# Altium project VoronChassisCircuitBoard.PrjPcb
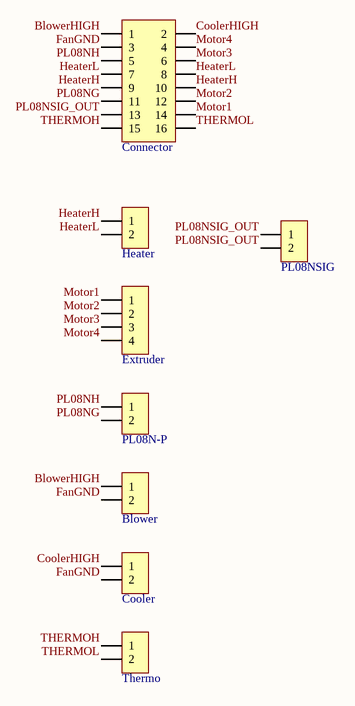
[diagram p0: Schematic.SchDoc]
1 sheet, 8 parts. Net scope: global (net labels, ports and power ports of the same name join across sheets).
Board file: Voron_Chassis_Circuit_PCB.PcbDoc

## Sheet Schematic.SchDoc
size A4

### Parts
Blower  HDR-1X2  [XH2.54-LI-2P]  (value not drawn)
Connector  Header 8X2  [IDC2.54-LI-2x8P]  (value not drawn)
Cooler  HDR-1X2  [XH2.54-LI-2P]  (value not drawn)
Extruder  HDR-1X4  [XH2.54-LI-4P]  (value not drawn)
Heater  HDR-1X2  [KF128-5.08-2P]  (value not drawn)
PL08N-P  HDR-1X2  [XH2.54-LI-2P]  (value not drawn)
PL08NSIG  HDR-1X2  [KF2510-LI-2P]  (value not drawn)
Thermo  HDR-1X2  [XH2.54-LI-2P]  (value not drawn)

### Nets
BlowerHIGH: Blower.1 Connector.1
CoolerHIGH: Connector.2 Cooler.1
FanGND: Blower.2 Connector.3 Cooler.2
HeaterH: Connector.9 Connector.10 Heater.1
HeaterL: Connector.7 Connector.8 Heater.2
Motor1: Connector.14 Extruder.1
Motor2: Connector.12 Extruder.2
Motor3: Connector.6 Extruder.3
Motor4: Connector.4 Extruder.4
PL08NG: Connector.11 PL08N-P.2
PL08NH: Connector.5 PL08N-P.1
PL08NSIG_OUT: Connector.13 PL08NSIG.1 PL08NSIG.2
THERMOH: Connector.15 Thermo.1
THERMOL: Connector.16 Thermo.2

### Library data of the parts
Blower Cooler PL08N-P PL08NSIG Thermo = Header 2: 2P接插件; 版权归属: 封装库来自淘宝 ID：黄晶宝石; BOM名称: 2P接插件; 联系售后: https://shop463601444.taobao.com
Connector = Header 8X2: 8*2P接插件; 版权归属: 封装库来自淘宝 ID：黄晶宝石; BOM名称: 8*2P接插件; 学习资源: https://shop463601444.taobao.com
Extruder = Header 4: 4P接插件; 版权归属: 封装库来自淘宝 ID：黄晶宝石; BOM名称: 4P接插件; 学习资源: https://shop463601444.taobao.com
Heater = Header 2: 2P接插件; 版权归属: 封装库来自淘宝卖家 ID：黄晶宝石; BOM名称: 2P接插件; 学习资源: https://shop463601444.taobao.com